# Altium schematic sheet MSP430.SchDoc
size A4
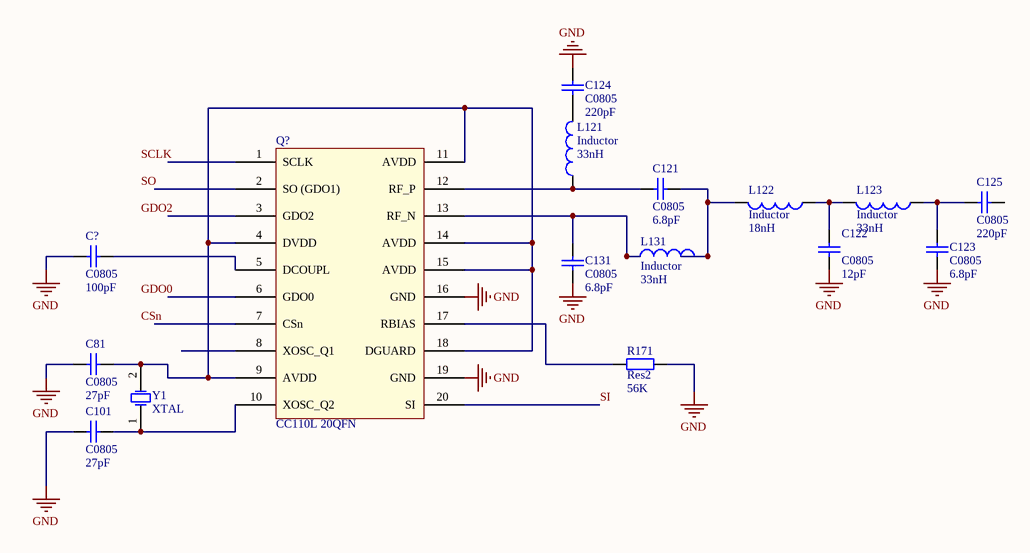
[diagram p0: MSP430.SchDoc]

## Parts
C81  C0805  value 27pF  [0805]
C101  C0805  value 27pF  [0805]
C121  C0805  value 6.8pF  [0805]
C122  C0805  value 12pF  [0805]
C123  C0805  value 6.8pF  [0805]
C124  C0805  value 220pF  [0805]
C125  C0805  value 220pF  [0805]
C131  C0805  value 6.8pF  [0805]
C?  C0805  value 100pF  [0805]
L121  Inductor  value 33nH  [0402-A]
L122  Inductor  value 18nH  [0402-A]
L123  Inductor  value 33nH  [0402-A]
L131  Inductor  value 33nH  [0402-A]
Q?  CC110L 20QFN  [CC110L_20QFN]
R171  Res2  value 56K  [AXIAL-0.4]
Y1  XTAL  [R38]

## Nets
GND: C81.1 C101.1 C122.1 C123.1 C124.2 C131.1 C?.1 Q?.16(GND) Q?.19(GND) R171.2
SI: Q?.20(SI)
NetC81_2: C81.2 Q?.4(DVDD) Q?.9(AVDD) Q?.11(AVDD) Q?.14(AVDD) Q?.15(AVDD) Q?.18(DGUARD) Y1.2(OSC2)
NetC101_2: C101.2 Q?.10(XOSC_Q2) Y1.1(OSC1)
NetC121_1: C121.1 L121.1 Q?.12(RF_P)
NetC121_2: C121.2 L122.2 L131.2
NetC122_2: C122.2 L122.1 L123.2
NetC123_2: C123.2 C125.1 L123.1
NetC124_1: C124.1 L121.2
NetC131_2: C131.2 L131.1 Q?.13(RF_N)
NetC?_2: C?.2 Q?.5(DCOUPL)
NetQ?_17: Q?.17(RBIAS) R171.1

Not connected (* = marked no-connect by the designer): C125 2; Q? 1(SCLK) 2(SO_(GDO1)) 3(GDO2) 6(GDO0) 7(CSn) 8(XOSC_Q1)

## Notes on the sheet
- Labels drawn without touching a wire or pin: CSn, GDO0, GDO2, SCLK, SO

## Library data of the parts
C81 C101 C121-C125 C131 C? = C0805: Ceramic Chip Capacitor - Standard; Note: Footprint corresponds to dimensions for bulk cassette packaging. This case size has tightened tolerances.; Published: 17-Jul-2002; LatestRevisionDate: 19-Mar-2004; LatestRevisionNote: Silkscreen size reduced.; DatasheetDocument: Mar-2001; PackageDocument: Mar-2001; PackageReference: 0805; Publisher: Altium Limited; Code_JEITA: 0805; Code_IPC: 2012[0805]; ComponentLink1Description: Manufacturer Link; ComponentLink1URL: http://www.kemet.com/; ComponentLink2Description: Datasheet; ComponentLink2URL: http://www.kemet.com/kemet/web/homepage/kechome.nsf/vapubfilesname/F3102TA.pdf/$file/F3102TA.pdf
L121-L123 L131 = Inductor: Code_IEC: 1005; Published: 8-Jun-2000; LatestRevisionDate: 29-May-2009; LatestRevisionNote: IPC-7351 Footprint Added.; PackageReference: 0402-A; Publisher: Altium Limited; PackageDescription: Chip Inductor; Code_JEITA: 0402
R171 = Res2: Resistor; Published: 8-Jun-2000; LatestRevisionDate: 17-Jul-2002; LatestRevisionNote: Re-released for DXP Platform.; PackageReference: AXIAL-0.4; Publisher: Altium Limited; PackageDescription: Axial Device, Thru-Hole; 2 Leads; 0.4 in Pin Spacing
Y1 = XTAL: Crystal Oscillator; Published: 8-Jun-2000; LatestRevisionDate: 17-Jul-2002; LatestRevisionNote: Re-released for DXP Platform.; PackageReference: R38; Publisher: Altium Limited; PackageDescription: Crystal, Thru-Hole; 2 Leads; Body 3.1 x 8.2 mm (Dia.xH)